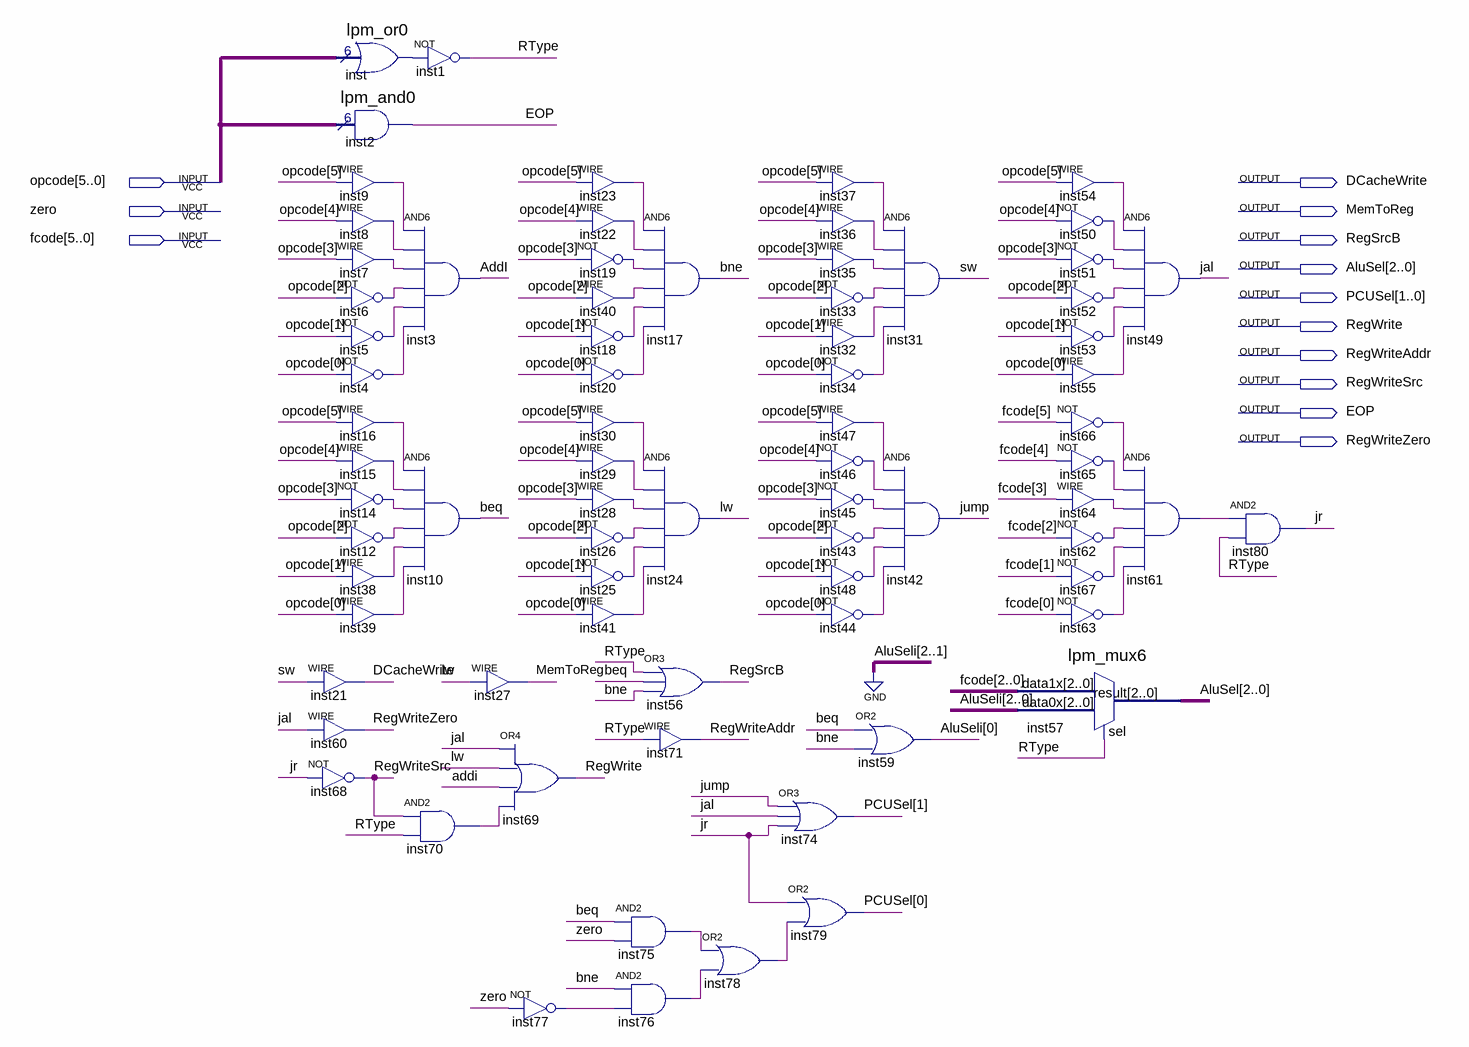
[diagram p0: schematic sheet]
// Quartus schematic ControlUnit.bdf as structural Verilog: 76 symbols, 13 pins
module ControlUnit (
  input  [5:0] opcode,
  input  zero,
  input  [5:0] fcode,
  output DCacheWrite,
  output MemToReg,
  output RegSrcB,
  output [2:0] AluSel,
  output [1:0] PCUSel,
  output RegWrite,
  output RegWriteAddr,
  output RegWriteSrc,
  output EOP,
  output RegWriteZero
);

  wire AddI, beq, bne, inst4_out, inst5_out, inst6_out, inst7_out, inst8_out, inst9_out, inst12_out,
       inst14_out, inst15_out, inst16_out, inst18_out, inst19_out, inst20_out, inst22_out, inst23_out,
       inst25_out, inst26_out, inst28_out, inst29_out, inst30_out, inst32_out, inst33_out, inst34_out,
       inst35_out, inst36_out, inst37_out, inst38_out, inst39_out, inst40_out, inst41_out, inst43_out,
       inst44_out, inst45_out, inst46_out, inst47_out, inst48_out, inst50_out, inst51_out, inst52_out,
       inst53_out, inst54_out, inst55_out, inst61_out, inst62_out, inst63_out, inst64_out, inst65_out,
       inst66_out, inst67_out, inst70_out, inst75_out, inst76_out, inst77_out, inst78_out, inst_result, jal,
       jr, jump, lw, RType, sw;
  wire [0:0] AluSeli;

  lpm_or0 inst (.data(opcode), .result(inst_result));
  lpm_and0 inst2 (.data(opcode), .result(EOP));
  assign inst9_out = opcode[5];  // WIRE inst9
  assign inst8_out = opcode[4];  // WIRE inst8
  assign inst7_out = opcode[3];  // WIRE inst7
  not inst6 (inst6_out, opcode[2]);
  not inst5 (inst5_out, opcode[1]);
  not inst4 (inst4_out, opcode[0]);
  assign inst16_out = opcode[5];  // WIRE inst16
  assign inst15_out = opcode[4];  // WIRE inst15
  not inst14 (inst14_out, opcode[3]);
  not inst12 (inst12_out, opcode[2]);
  assign inst38_out = opcode[1];  // WIRE inst38
  assign inst39_out = opcode[0];  // WIRE inst39
  assign DCacheWrite = sw;  // WIRE inst21
  assign RegWriteZero = jal;  // WIRE inst60
  not inst68 (RegWriteSrc, jr);
  not inst1 (RType, inst_result);
  and inst3 (AddI, inst9_out, inst8_out, inst7_out, inst6_out, inst5_out, inst4_out);
  and inst10 (beq, inst16_out, inst15_out, inst14_out, inst12_out, inst38_out, inst39_out);
  and inst70 (inst70_out, RegWriteSrc, RType);
  assign MemToReg = lw;  // WIRE inst27
  or inst69 (RegWrite, jal, lw, AddI, inst70_out);
  not inst77 (inst77_out, zero);
  assign inst23_out = opcode[5];  // WIRE inst23
  assign inst22_out = opcode[4];  // WIRE inst22
  not inst19 (inst19_out, opcode[3]);
  assign inst40_out = opcode[2];  // WIRE inst40
  not inst18 (inst18_out, opcode[1]);
  not inst20 (inst20_out, opcode[0]);
  assign inst30_out = opcode[5];  // WIRE inst30
  assign inst29_out = opcode[4];  // WIRE inst29
  assign inst28_out = opcode[3];  // WIRE inst28
  not inst26 (inst26_out, opcode[2]);
  not inst25 (inst25_out, opcode[1]);
  assign inst41_out = opcode[0];  // WIRE inst41
  and inst17 (bne, inst23_out, inst22_out, inst19_out, inst40_out, inst18_out, inst20_out);
  and inst24 (lw, inst30_out, inst29_out, inst28_out, inst26_out, inst25_out, inst41_out);
  or inst56 (RegSrcB, RType, beq, bne);
  assign RegWriteAddr = RType;  // WIRE inst71
  and inst75 (inst75_out, beq, zero);
  and inst76 (inst76_out, bne, inst77_out);
  or inst78 (inst78_out, inst75_out, inst76_out);
  assign inst37_out = opcode[5];  // WIRE inst37
  assign inst36_out = opcode[4];  // WIRE inst36
  assign inst35_out = opcode[3];  // WIRE inst35
  not inst33 (inst33_out, opcode[2]);
  assign inst32_out = opcode[1];  // WIRE inst32
  not inst34 (inst34_out, opcode[0]);
  assign inst47_out = opcode[5];  // WIRE inst47
  not inst46 (inst46_out, opcode[4]);
  not inst45 (inst45_out, opcode[3]);
  not inst43 (inst43_out, opcode[2]);
  not inst48 (inst48_out, opcode[1]);
  not inst44 (inst44_out, opcode[0]);
  or inst74 (PCUSel[1], jump, jal, jr);
  or inst79 (PCUSel[0], jr, inst78_out);
  and inst31 (sw, inst37_out, inst36_out, inst35_out, inst33_out, inst32_out, inst34_out);
  and inst42 (jump, inst47_out, inst46_out, inst45_out, inst43_out, inst48_out, inst44_out);
  or inst59 (AluSeli[0], beq, bne);
  assign inst54_out = opcode[5];  // WIRE inst54
  not inst50 (inst50_out, opcode[4]);
  not inst51 (inst51_out, opcode[3]);
  not inst52 (inst52_out, opcode[2]);
  not inst53 (inst53_out, opcode[1]);
  assign inst55_out = opcode[0];  // WIRE inst55
  not inst66 (inst66_out, fcode[5]);
  not inst65 (inst65_out, fcode[4]);
  assign inst64_out = fcode[3];  // WIRE inst64
  not inst62 (inst62_out, fcode[2]);
  not inst67 (inst67_out, fcode[1]);
  not inst63 (inst63_out, fcode[0]);
  lpm_mux6 inst57 (.data1x(fcode[2:0]), .data0x({2'b00, AluSeli[0]}), .sel(RType), .result(AluSel));
  and inst49 (jal, inst54_out, inst50_out, inst51_out, inst52_out, inst53_out, inst55_out);
  and inst61 (inst61_out, inst66_out, inst65_out, inst64_out, inst62_out, inst67_out, inst63_out);
  and inst80 (jr, inst61_out, RType);
endmodule
